# EAGLE design mytracer (EAGLE 7.1.0)
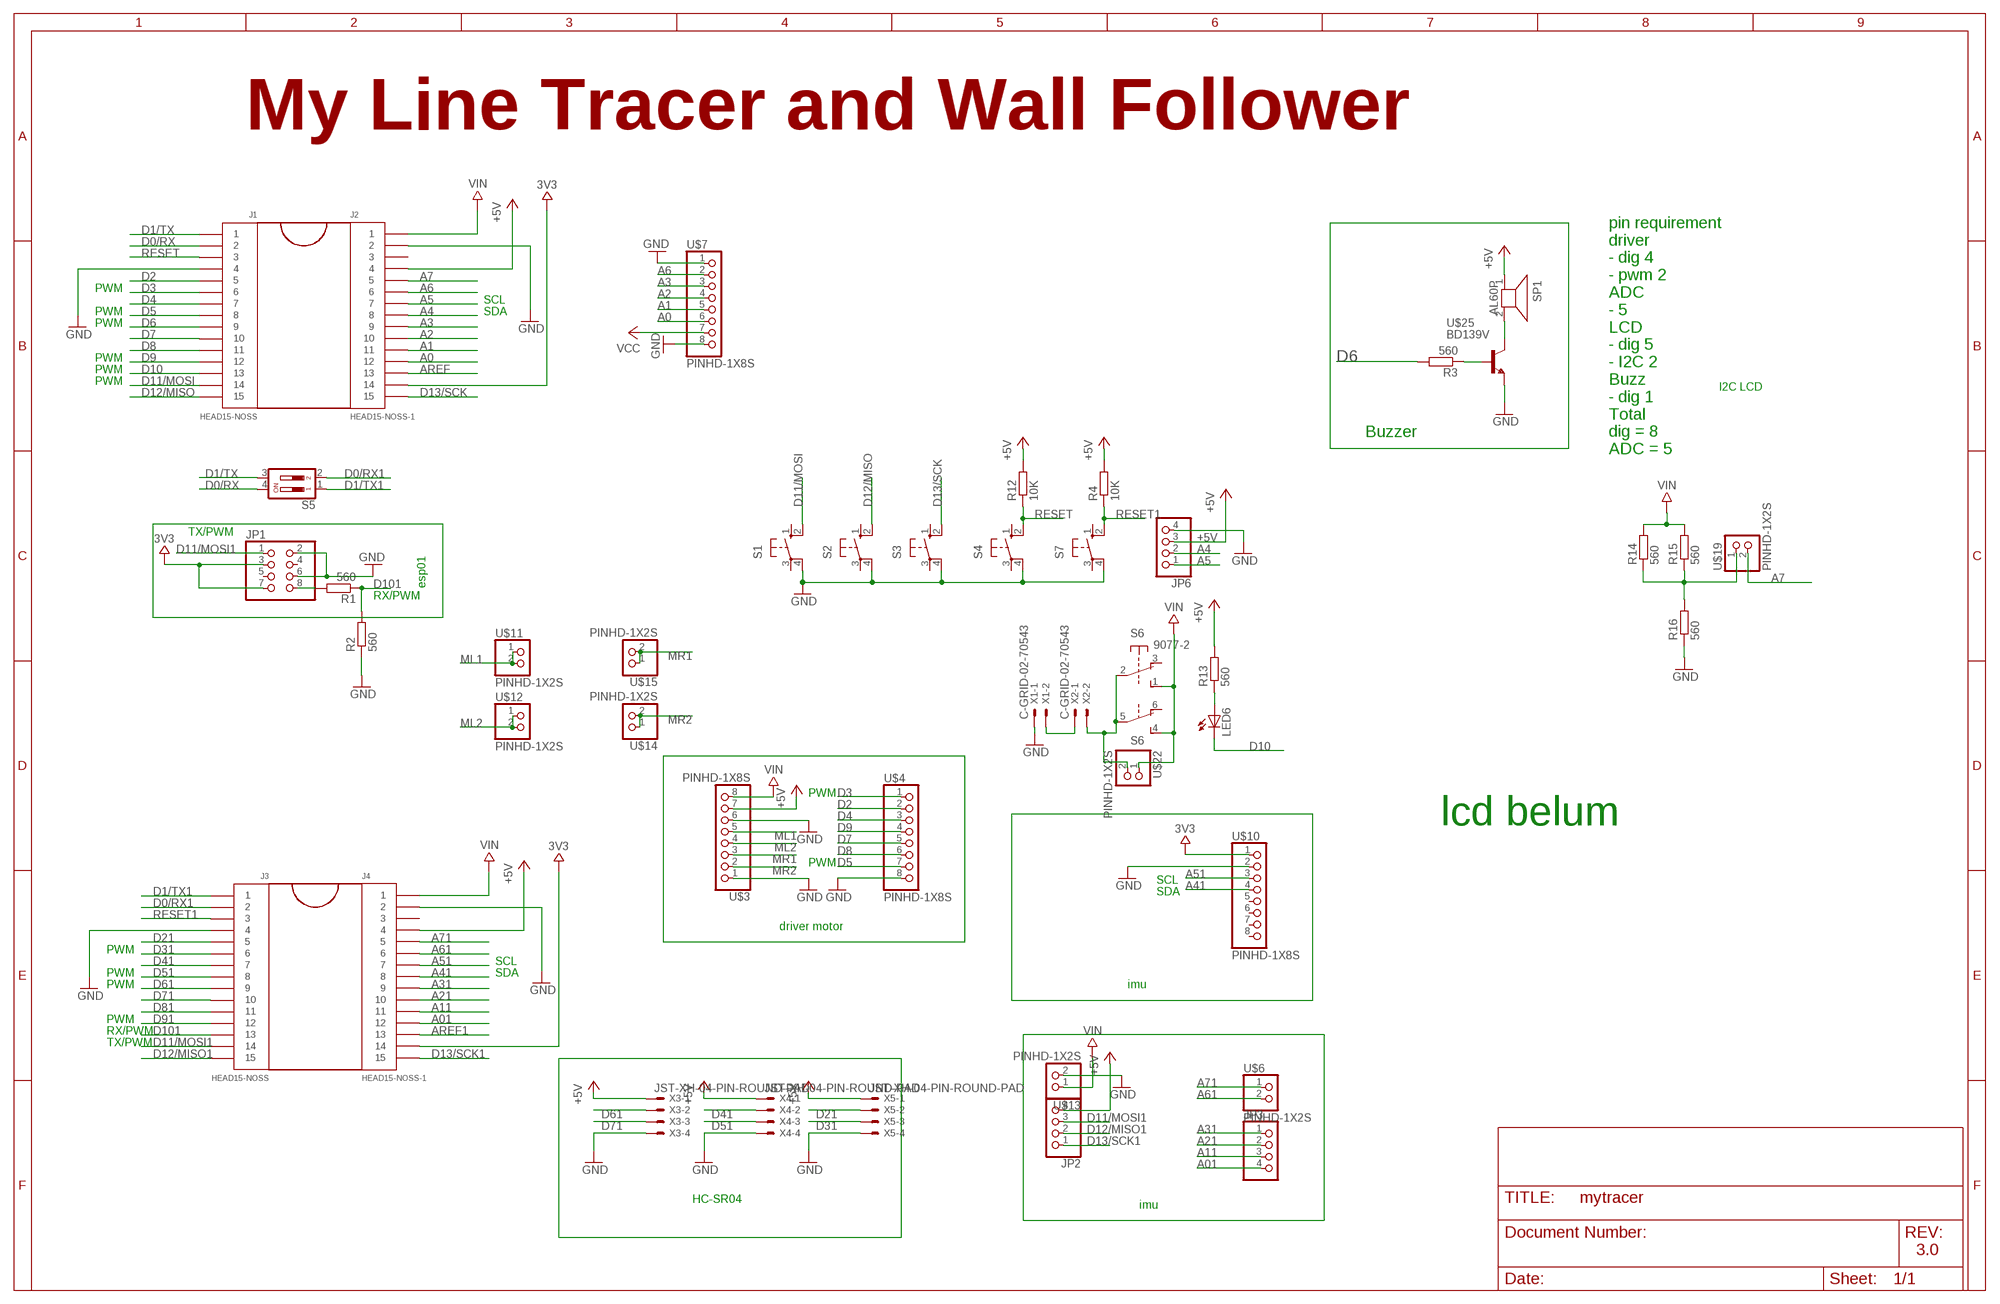
[diagram p0: schematic, sheet 1]

## Parts
J1  HEAD15-NOSS  [HEAD15-NOSS]
J2  HEAD15-NOSS-1  [HEAD15-NOSS-1]
J3  HEAD15-NOSS  [HEAD15-NOSS]
J4  HEAD15-NOSS-1  [HEAD15-NOSS-1]
JP1  PINHD-2X4  [2X04]
JP2  PINHD-1X4  [1X04]
JP3  PINHD-1X4  [1X04]
JP6  PINHD-1X4  [1X04]
LED6  LED3MM  [LED3MM]
R1  560  R-EU_M1206  [M1206]
R2  560  R-EU_M1206  [M1206]
R3  560  R-EU_M1206  [M1206]
R4  10K  R-EU_M1206  [M1206]
R12  10K  R-EU_M1206  [M1206]
R13  560  R-EU_M1206  [M1206]
R14  560  R-EU_M1206  [M1206]
R15  560  R-EU_M1206  [M1206]
R16  560  R-EU_M1206  [M1206]
S1  10-XX  [B3F-10XX]
S2  10-XX  [B3F-10XX]
S3  10-XX  [B3F-10XX]
S4  10-XX  [B3F-10XX]
S5  DIP02YL  [DIP02YL]
S6  9077-2  [9077-2]
S7  10-XX  [B3F-10XX]
SP1  AL60P  [AL60P]
U$3  PINHD-1X8S  [1X08S]
U$4  PINHD-1X8S  [1X08S]
U$6  PINHD-1X2S  [1X02S]
U$7  PINHD-1X8S  [1X08S]
U$10  PINHD-1X8S  [1X08S]
U$11  PINHD-1X2S  [1X02S]
U$12  PINHD-1X2S  [1X02S]
U$13  PINHD-1X2S  [1X02S]
U$14  PINHD-1X2S  [1X02S]
U$15  PINHD-1X2S  [1X02S]
U$19  PINHD-1X2S  [1X02S]
U$22  PINHD-1X2S  [1X02S]
U$25  BD139V  [TO126V]
X1  C-GRID-02-70543  [70543-02]
X2  C-GRID-02-70543  [70543-02]
X3  JST-XH-04-PIN-ROUND-PAD  [JST-XH-04-PACKAGE-ROUND-PAD]
X4  JST-XH-04-PIN-ROUND-PAD  [JST-XH-04-PACKAGE-ROUND-PAD]
X5  JST-XH-04-PIN-ROUND-PAD  [JST-XH-04-PACKAGE-ROUND-PAD]

## Nets
3V3: J2.14 J4.14 JP1.3 JP1.7 U$10.1
+5V: J2.4 J4.4 JP2.4 JP6.3 R4.2 R12.2 R13.2 SP1.1 U$3.7 X3.1 X4.1 X5.1
A0: J2.12 U$7.6
A1: J2.11 U$7.5
A01: J4.12 JP3.4
A2: J2.10 U$7.4
A3: J2.9 U$7.3
A4: J2.8 JP6.2
A5: J2.7 JP6.1
A6: J2.6 U$7.2
A7: J2.5 U$19.2
A11: J4.11 JP3.3
A21: J4.10 JP3.2
A31: J4.9 JP3.1
A41: J4.8 U$10.4
A51: J4.7 U$10.3
A61: J4.6 U$6.2
A71: J4.5 U$6.1
AREF: J2.13
AREF1: J4.13
D0/RX: J1.2 S5.4
D0/RX1: J3.2 S5.2
D1/TX: J1.1 S5.3
D1/TX1: J3.1 S5.1
D2: J1.5 U$4.2
D3: J1.6 U$4.1
D4: J1.7 U$4.3
D5: J1.8 U$4.7
D6: J1.9 R3.2
D7: J1.10 U$4.5
D8: J1.11 U$4.6
D9: J1.12 U$4.4
D10: J1.13 LED6.K(C)
D11/MOSI: J1.14 S1.2(S1)
D11/MOSI1: J3.14 JP1.1 JP2.3
D12/MISO: J1.15 S2.2(S1)
D12/MISO1: J3.15 JP2.2
D13/SCK: J2.15 S3.2(S1)
D13/SCK1: J4.15 JP2.1
D21: J3.5 X5.2
D31: J3.6 X5.3
D41: J3.7 X4.2
D51: J3.8 X4.3
D61: J3.9 X3.2
D71: J3.10 X3.3
D81: J3.11
D91: J3.12
D101: J3.13 R1.1 R2.2
GND: J1.4 J2.2 J3.4 J4.2 JP1.2 JP1.6 JP6.4 R2.1 R16.1 S1.4(P1) S2.4(P1) S3.4(P1) S4.4(P1) S7.4(P1) U$3.1 U$3.6 U$4.8 U$7.1 U$7.8 U$10.2 U$13.2 U$25.1(E) X1.1 X3.4 X4.4 X5.4
ML1: U$3.5 U$11.1 U$11.2
ML2: U$3.4 U$12.1 U$12.2
MR1: U$3.3 U$15.1 U$15.2
MR2: U$3.2 U$14.1 U$14.2
N$2: R14.1 R15.1 R16.2 U$19.1
N$12: JP1.8 R1.2
N$13: X1.2 X2.1
N$16: S6.2(1:P) S6.5(2:P) U$22.2 X2.2
N$17: LED6.A R13.1
N$34: R3.1 U$25.3(B)
N$35: SP1.2 U$25.2(C)
RESET: J1.3 R12.1 S4.2(S1)
RESET1: J3.3 R4.1 S7.2(S1)
VCC: U$7.7
VIN: J2.1 J4.1 R14.2 R15.2 S6.1(1:S) S6.4(2:S) U$3.8 U$13.1 U$22.1
Unconnected: J2.3 J4.3 JP1.4 JP1.5 S1.1(S) S1.3(P) S2.1(S) S2.3(P) S3.1(S) S3.3(P) S4.1(S) S4.3(P) S6.3(1:O) S6.6(2:O) S7.1(S) S7.3(P) U$10.5 U$10.6 U$10.7 U$10.8

## Notes on the sheet
- My Line Tracer and Wall Follower
- PWM
- SCL
- PWM | SDA
- PWM
- PWM
- PWM
- PWM
- I2C LCD
- Buzzer
- pin requirement
  driver
  - dig 4
  - pwm 2
  ADC
  - 5
  LCD
  - dig 5
  - I2C 2
  Buzz
  - dig 1
  Total 
  dig = 8
  ADC = 5
- TX/PWM
- esp01
- RX/PWM
- PWM
- lcd belum
- PWM
- SCL
- SDA
- driver motor
- PWM
- SCL
- PWM | SDA
- PWM | imu
- PWM
- RX/PWM
- TX/PWM
- HC-SR04
- imu
- 3.0

## Library data of the parts
J1 J3 = MyCON2:HEAD15-NOSS
J2 J4 = MyCON2:HEAD15-NOSS-1
JP1 = pinhead:PINHD-2X4: PIN HEADER
JP2 JP3 JP6 = pinhead:PINHD-1X4: PIN HEADER
LED6 = led:LED: LED OSRAM: - CHIPLED LG R971, LG N971, LY N971, LG Q971, LY Q971, LO R971, LY R971 LH N974, LH R974 LS Q976, LO Q976, LY Q976 LO Q996 - Hyper CHIPLED LW Q18S LB Q993, LB Q99A, LB R99A - SideLED LS A670, LO A670, LY A670, LG A670, LP A670 LB A673, LV A673, LT A673, LW A673 LH A674 LY A675 LS A676, LA A676, LO A676, LY A676, LW A676 LS A679, LY A679, LG A679 - Hyper Micro SIDELED® LS Y876, LA Y876, LO Y876, LY Y876 LT Y87S - SmartLED LW L88C, LW L88S LB L89C, LB L89S, LG L890 LS L89K, LO L89K, LY L89K LS L896, LA L896, LO L896, LY L896 - TOPLED LS T670, LO T670, LY T670, LG T670, LP T670 LSG T670, LSP T670, LSY T670, LOP T670, LYG T670 LG T671, LOG T671, LSG T671 LB T673, LV T673, LT T673, LW T673 LH T674 LS T676, LA T676, LO T676, LY T676, LB T676, LH T676, LSB T676, LW T676 LB T67C, LV T67C, LT T67C, LS T67K, LO T67K, LY T67K, LW E67C LS E67B, LA E67B, LO E67B, LY E67B, LB E67C, LV E67C, LT E67C LW T67C LS T679, LY T679, LG T679 LS T770, LO T770, LY T770, LG T770, LP T770 LB T773, LV T773, LT T773, LW T773 LH T774 LS E675, LA E675, LY E675, LS T675 LS T776, LA T776, LO T776, LY T776, LB T776 LHGB T686 LT T68C, LB T68C - Hyper Mini TOPLED® LB M676 - Mini TOPLED Santana® LG M470 LS M47K, LO M47K, LY M47K Source: http://www.osram.convergy.de LUXEON: - LUMILED® LXK2-PW12-R00, LXK2-PW12-S00, LXK2-PW14-U00, LXK2-PW14-V00 LXK2-PM12-R00, LXK2-PM12-S00, LXK2-PM14-U00 LXK2-PE12-Q00, LXK2-PE12-R00, LXK2-PE12-S00, LXK2-PE14-T00, LXK2-PE14-U00 LXK2-PB12-K00, LXK2-PB12-L00, LXK2-PB12-M00, LXK2-PB14-N00, LXK2-PB14-P00, LXK2-PB14-Q00 LXK2-PR12-L00, LXK2-PR12-M00, LXK2-PR14-Q00, LXK2-PR14-R00 LXK2-PD12-Q00, LXK2-PD12-R00, LXK2-PD12-S00 LXK2-PH12-R00, LXK2-PH12-S00 LXK2-PL12-P00, LXK2-PL12-Q00, LXK2-PL12-R00 Source: www.luxeon.com KINGBRIGHT: KA-3528ASYC Source: www.kingbright.com
R1-R4 R12-R16 = rcl:R-EU_: RESISTOR, European symbol
S1-S4 S7 = switch-omron:10-XX: OMRON SWITCH; MPN: B3F-1000; OC_FARNELL: 176432; OC_NEWARK: 36M3542
S5 = switch-dil:DIP02YL: DIL/CODE SWITCH; OC_FARNELL: unknown; OC_NEWARK: unknown
S6 = switch-misc:9077-2: MARQUARDT SWITCH 9077.0200 Distributor: Buerklin <https://www.buerklin.com/default.asp?event=ShowArtikel%2812G2822%29&l=d&jump=ArtNr_12G2822>
SP1 = buzzer:AL60P: SPEAKER Source: Buerklin; OC_FARNELL: unknown; OC_NEWARK: unknown
U$3 U$4 U$7 U$10 = pinhead:PINHD-1X8S
U$6 U$11-U$15 U$19 U$22 = pinhead:PINHD-1X2S
U$25 = transistor-npn:BD139V
X1 X2 = con-molex:C-GRID-02: CONNECTOR wire to board 2.54 mm (0.100") pitch header; OC_FARNELL: unknown; OC_NEWARK: unknown
X3-X5 = JST XH Connectors v1-0:JST-XH-04-PIN: JST XH Connector 2 Pin Wire to board connector. Pitch: 2,54 mm, (0.100") Number of pins: 4 Created by Rembrandt Electronics www.rembrandtelectronics.com

## Net classes
0 default: width 0.203 mm

## Board
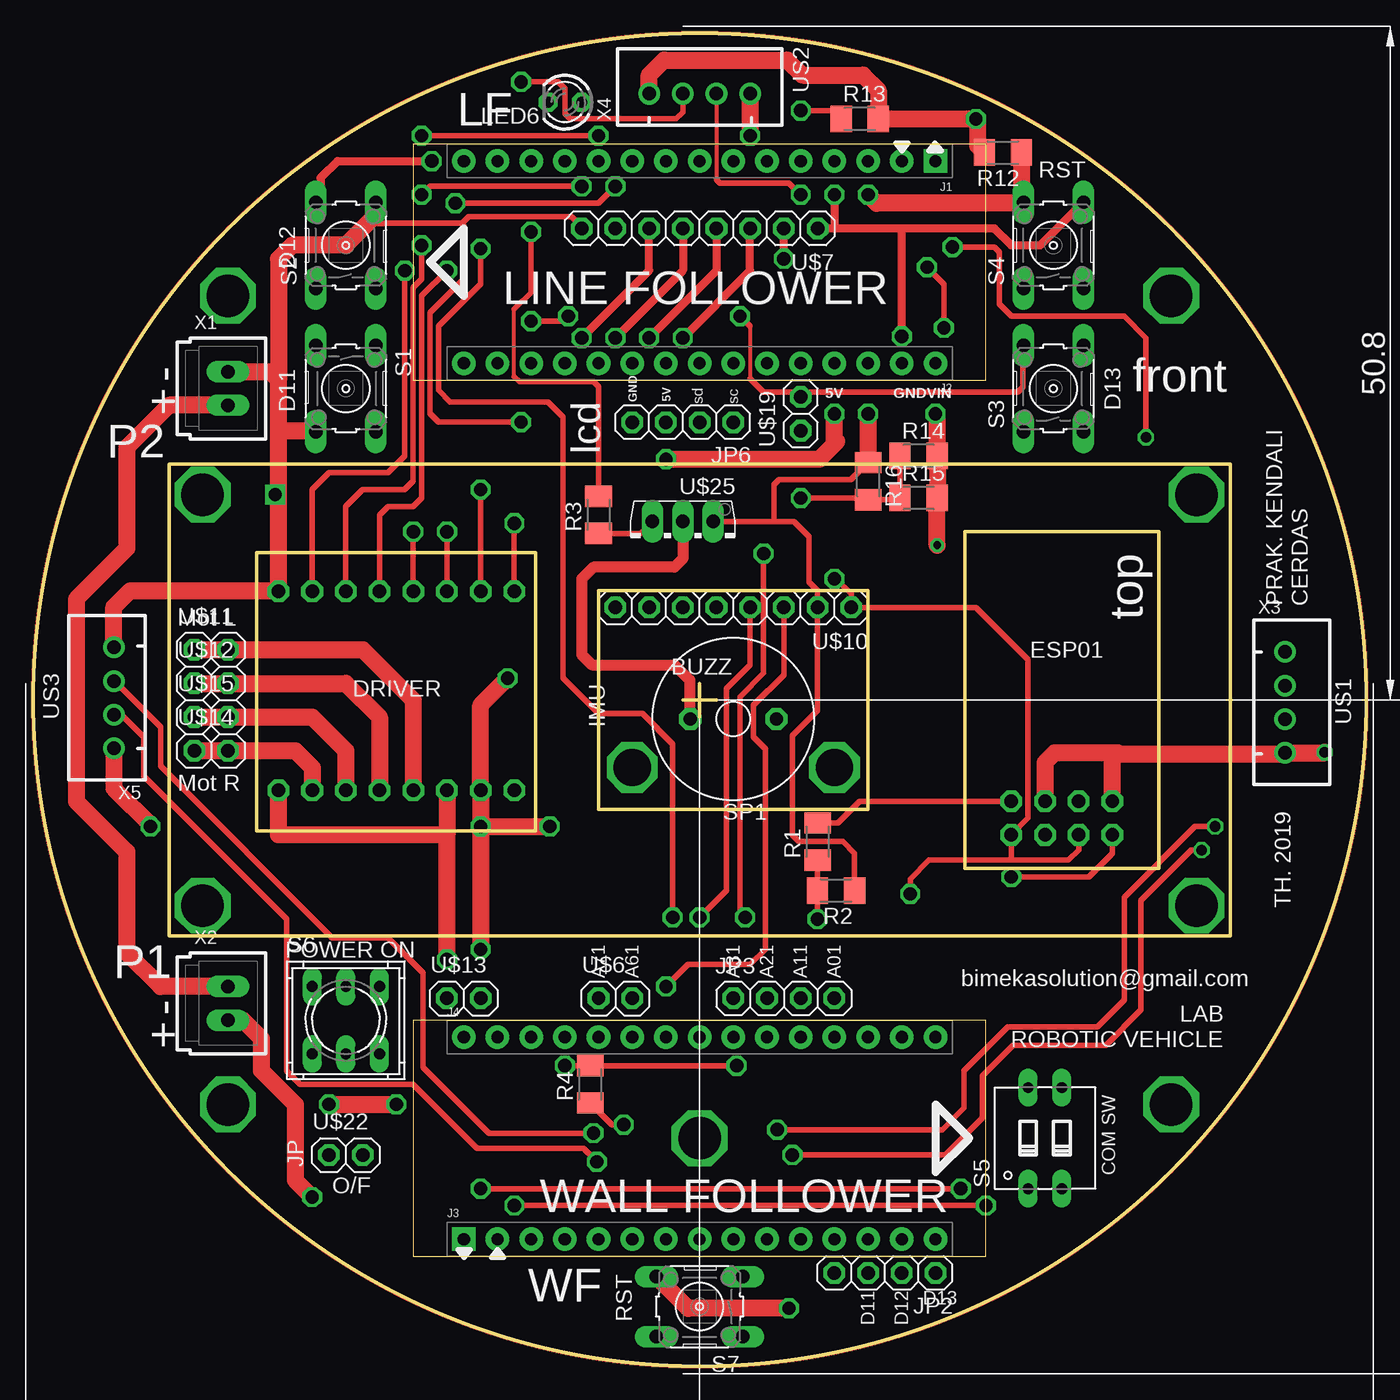
[diagram p1: board, top side]
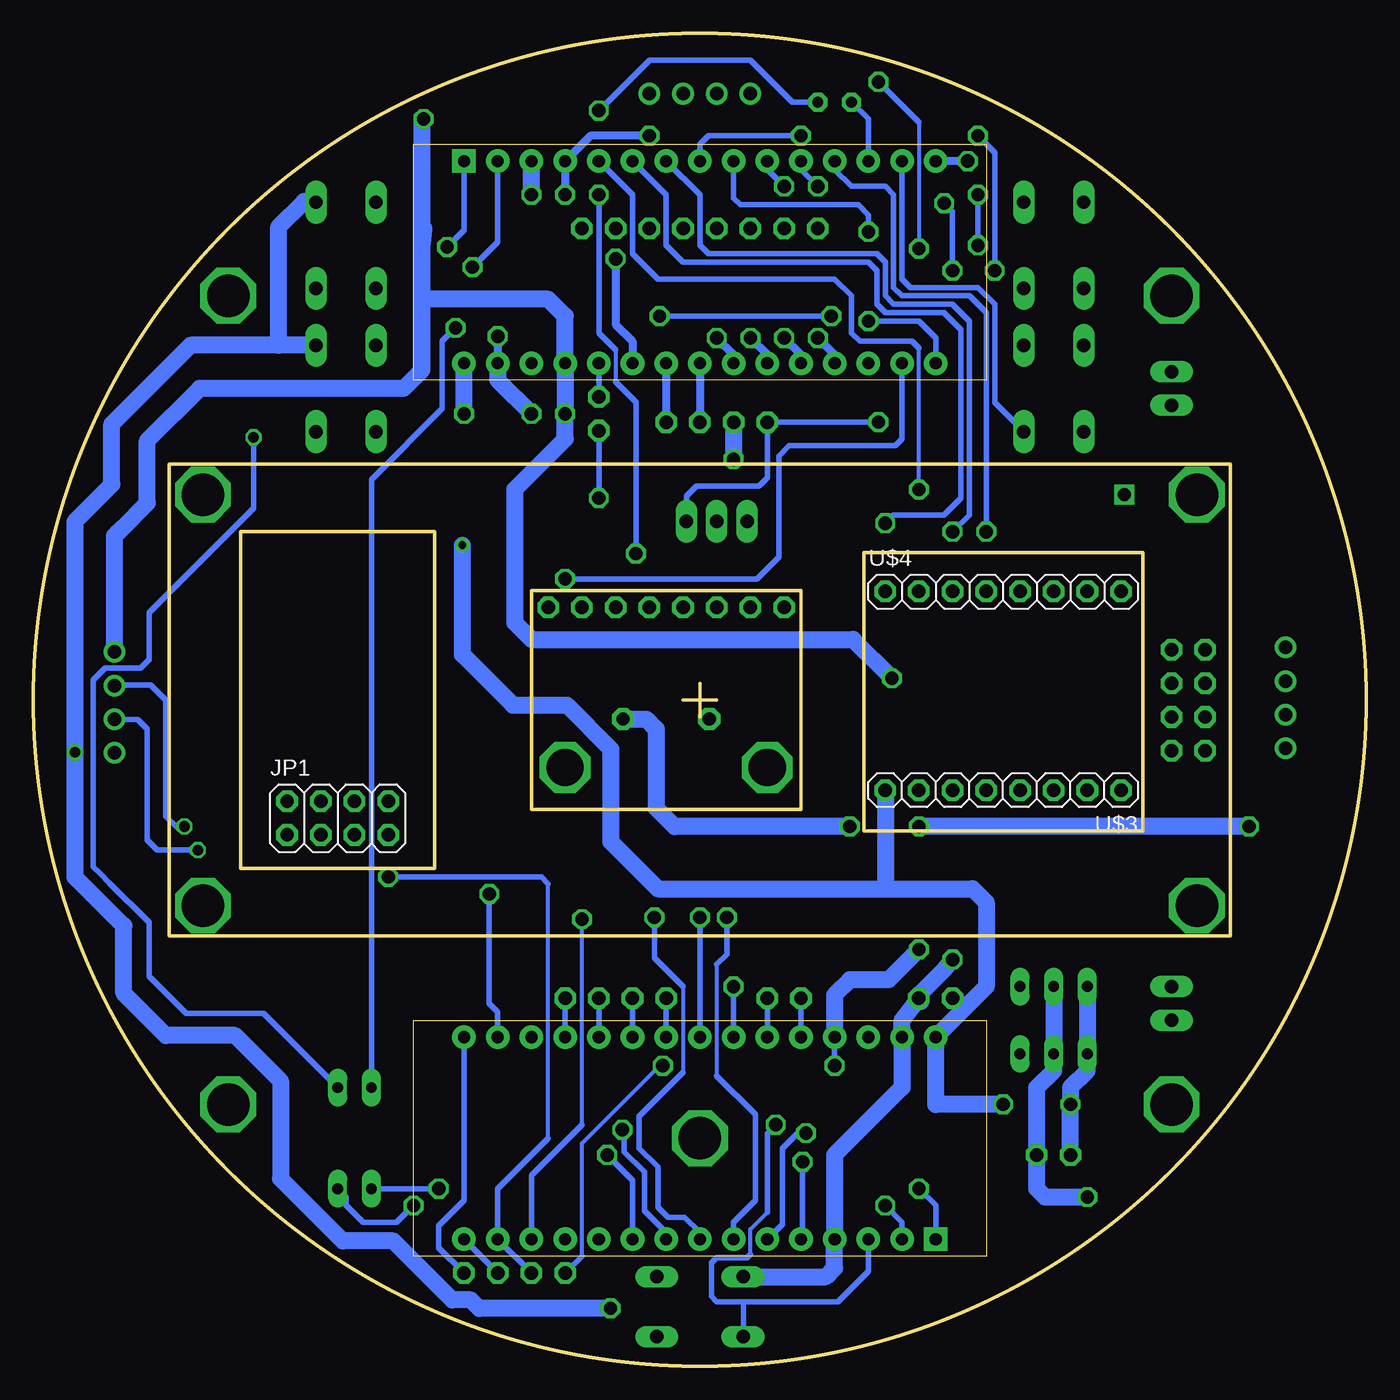
[diagram p2: board, bottom side, seen from below]

Size 100.5 x 100.5 mm. Coordinates in mm from the lower left corner, seen from the top.
Outline: 50.24,51.49 50.24,48.95
Outline: 48.97,50.22 51.51,50.22
Outline: 28.65,92.13 28.65,74.35 71.83,74.35 71.83,92.13 28.65,92.13
Outline: 71.83,8.31 71.83,26.09 28.65,26.09 28.65,8.31 71.83,8.31
Outline: 62.94,58.47 42.62,58.47 42.62,41.96 62.94,41.96 62.94,58.47
Outline: 70.24,37.52 84.85,37.52 84.85,62.92 70.24,62.92 70.24,37.52
Outline: 16.84,40.38 37.86,40.38 37.86,61.33 16.84,61.33 16.84,40.38
Outline: 10.23,68 90.24,68 90.24,32.44 10.23,32.44 10.23,68
Outline: circle at 50.25,50.25 radius 50.25
Copper layers (1*16): Top 0.035mm / dielectric 1.5mm / Bottom 0.035mm
Design rules "default *": minimum track width 8mil, minimum drill 16mil, track to track 8mil, track to pad 8mil, pad to pad 8mil, via to via 8mil, smd to smd 8mil, copper to edge 8mil, drill to drill 8mil, minimum pad ring 12mil, minimum via ring 8mil, stop-mask expansion 4mil, vias tented up to drill 18mil, thermal gap 10mil

### Footprints (pad centres in the part's own frame; a part is rotated, then mirrored left to right if it is on the bottom)
HEAD15-NOSS = drill 0.914 pad 1.778 square: 1 0,0 | drill 0.914 pad 1.778: 2 2.54,0; 3 5.08,0; 4 7.62,0; 5 10.16,0; 6 12.7,0; 7 15.24,0; 8 17.78,0; 9 20.32,0; 10 22.86,0; 11 25.4,0; 12 27.94,0; 13 30.48,0; 14 33.02,0; 15 35.56,0
HEAD15-NOSS-1 = drill 0.914 pad 1.778: 1 0,0; 2 2.54,0; 3 5.08,0; 4 7.62,0; 5 10.16,0; 6 12.7,0; 7 15.24,0; 8 17.78,0; 9 20.32,0; 10 22.86,0; 11 25.4,0; 12 27.94,0; 13 30.48,0; 14 33.02,0; 15 35.56,0
2X04 = drill 1.016 octagon: 1 -3.81,-1.27; 2 -3.81,1.27; 3 -1.27,-1.27; 4 -1.27,1.27; 5 1.27,-1.27; 6 1.27,1.27; 7 3.81,-1.27; 8 3.81,1.27
1X04 = drill 1.016 octagon: 1 -3.81,0; 2 -1.27,0; 3 1.27,0; 4 3.81,0
LED3MM = drill 0.813 octagon: A -1.27,0; K 1.27,0
M1206 = smd 1.6 x 2: 1 -1.4,0; 2 1.4,0
B3F-10XX = drill 1.016 long: 1 -3.251,2.261; 2 3.251,2.261; 3 -3.251,-2.261; 4 3.251,-2.261
DIP02YL = drill 0.813 long: 1 -1.27,-3.81; 2 1.27,-3.81; 3 1.27,3.81; 4 -1.27,3.81
9077-2 = drill 0.813 long: 1 -2.54,2.54; 2 0,2.54; 3 2.54,2.54; 4 -2.54,-2.54; 5 0,-2.54; 6 2.54,-2.54
AL60P = drill 1 pad 1.676 octagon: 1 -3.251,0; 2 3.251,0
1X08S = drill 1.016 octagon: 1 -8.89,-1.27; 2 -6.35,-1.27; 3 -3.81,-1.27; 4 -1.27,-1.27; 5 1.27,-1.27; 6 3.81,-1.27; 7 6.35,-1.27; 8 8.89,-1.27
1X02S = drill 1.016 octagon: 1 -1.27,0; 2 1.27,0
TO126V = drill 1.016 long: 1 -2.286,-1.27; 2 0,-1.27; 3 2.286,-1.27
70543-02 = drill 1.016 long: 1 -1.27,0; 2 1.27,0
JST-XH-04-PACKAGE-ROUND-PAD = drill 1.016: 1 -3.81,0; 2 -1.27,0; 3 1.27,0; 4 3.81,0

### Placement (x,y rotation side)
J1  68.02,90.86 180 top
J2  68.02,75.62 180 top
J3  32.46,9.58 0 top
J4  32.46,24.82 0 top
JP1  77.54,41.33 0 bottom
JP2  64.21,7.04 180 top
JP3  56.59,27.74 0 top
JP6  48.97,71.17 180 top
LED6  40.08,95.3 180 top
R1  59.13,39.55 90 top
R2  60.53,35.87 180 top
R3  42.62,64.19 90 top
R4  41.98,21.26 90 top
R12  73.1,91.49 180 top
R13  62.3,94.03 0 top
R14  66.75,68.63 0 top
R15  66.75,65.46 0 top
R16  62.94,66.73 270 top
S1  23.57,73.71 270 top
S2  23.57,84.51 90 top
S3  76.91,73.71 90 top
S4  76.91,84.51 90 top
S5  76.27,17.2 0 top
S6  23.57,26.09 0 top
S7  50.24,4.5 180 top
SP1  52.78,48.8 180 top
U$3  27.38,42.15 180 bottom
U$4  27.38,59.68 0 bottom
U$6  43.89,27.74 0 top
U$7  50.24,84.51 180 top
U$10  52.78,55.93 180 top
U$11  13.41,54.03 0 top
U$12  13.41,51.49 0 top
U$13  32.46,27.74 0 top
U$14  13.41,46.41 0 top
U$15  13.41,48.95 0 top
U$19  57.86,71.81 90 top
U$22  23.57,15.93 0 top
U$25  48.97,62.44 180 top
X1  14.68,73.71 270 top
X2  14.68,27.36 270 top
X3  94.37,50.05 270 top
X4  50.24,95.94 0 top
X5  6.08,50.39 90 top

### Tracks (layer width: path | path; a pad name or v marks a point on that pad's centre or on a via)
3V3  (via drill 1)
  Top 0.406: 73.73,38.15 JP1.7 75,41.33 75,53.27 71.07,57.2 U$10.1 61.67,58.22 60.53,59.36 v60.4,59.36 | 73.73,38.15 67.51,38.15 66.11,36.76 v66.11,35.61 | 73.73,38.15 78.05,38.15 78.81,38.92 JP1.3
  Bottom 0.406: J4.14 65.48,26.72 66.11,27.36 v66.11,35.61 | v60.4,59.36 45.92,59.36 44.27,61.01 44.27,68.63 43.51,69.4 35.51,69.4 35,69.9 J2.14
+5V  (via drill 1)
  Top 0.406: v40.08,22.66 R4.2 v53.03,22.66
  Top 1.27: v33.73,40.69 U$3.7 33.73,49.84 v35.76,51.87 | X5.1 6.08,43.57 8.96,40.69 v8.84,40.69 | R12.2 71.19,92 71.19,94.03 v71.07,94.03 R13.2 63.7,96.19 62.56,97.34 57.99,97.34 56.84,98.48 47.57,98.48 46.43,97.34 X4.1 | v47.7,68.38 59.26,68.38 60.59,69.71 60.4,69.9 v60.4,71.81 | v33.73,40.69 v38.94,40.69 | v33.73,40.69 v33.73,31.42
  Bottom 0.305: 59.13,8.31 59.13,16.82 53.29,22.66 v53.03,22.66
  Bottom 0.406: J4.4 v40.08,22.66 | JP2.4 59.13,8.31
  Bottom 1.27: v8.84,40.69 v33.73,40.69 | 71.19,80.44 71.19,75.11 72.59,73.71 87.96,73.71 91.89,69.78 91.89,65.08 93.8,63.17 94.01,62.96 94.37,62.6 X3.1 | 71.19,80.44 71.19,84.64 | 71.19,84.64 71.19,93.91 v71.07,94.03 | 71.07,85.78 71.19,84.64 | JP6.3 v47.7,68.38 | 71.19,80.44 61.67,80.44 60.4,79.17 J2.4 v60.4,71.81 60.4,69.9 64.21,66.09 64.21,56.06 62.94,54.79 38.68,54.79 v35.76,51.87 | v38.94,40.69 52.14,40.69 53.54,42.09 53.54,48.06 54.28,48.8 SP1.1 | v33.73,31.42 36.01,29.14 38.94,29.14 40.08,27.99 J4.4
A0  (via drill 1)
  Top 0.61: v41.35,77.52 46.43,82.6 U$7.6
  Bottom 0.61: J2.12 40.08,76.25 v41.35,77.52
A1  (via drill 1)
  Top 0.61: U$7.5 48.97,82.6 v43.89,77.52
  Bottom 0.61: J2.11 42.62,76.25 v43.89,77.52
A01
  Bottom 0.406: J4.12 JP3.4
A2  (via drill 1)
  Top 0.61: U$7.4 51.51,82.6 v46.43,77.52
  Bottom 0.61: v46.43,77.52 45.16,76.25 J2.10
A3  (via drill 1)
  Top 0.61: v48.97,77.52 54.05,82.6 U$7.3
  Bottom 0.61: v48.97,77.52 47.7,76.25 J2.9
A4
  Bottom 0.61: J2.8 JP6.2
A5
  Bottom 0.61: J2.7 JP6.1
A6  (via drill 1)
  Top 0.61: v56.59,83.49 U$7.2
  Bottom 0.61: 55.32,76.25 J2.6 55.32,77.27 56.59,78.54 v56.59,83.49
A7
  Bottom 0.406: J2.5 U$19.2
A11
  Bottom 0.406: J4.11 JP3.3
A21
  Bottom 0.406: J4.10 JP3.2
A31
  Bottom 0.406: J4.9 JP3.1
A41  (via drill 1)
  Top 0.406: U$10.4 54.05,52.89 52.27,51.11 52.27,35.87 v50.24,33.84
  Bottom 0.406: J4.8 v50.24,33.84
A51  (via drill 1)
  Top 0.406: v47.7,28.63 49.35,30.28 54.05,30.28 55.19,31.42 55.19,46.54 54.3,47.42 54.3,49.84 56.59,52.12 U$10.3
  Bottom 0.406: v47.7,28.63 J4.7
A61
  Bottom 0.406: J4.6 U$6.2
A71
  Bottom 0.406: J4.5 U$6.1
D0/RX  (via drill 1)
  Top 0.406: v67.38,82.86 68.65,81.59 v68.65,78.29
  Bottom 0.406: J1.2 65.48,84.76 v67.38,82.86 | v68.65,78.29 69.67,77.27 69.67,72.19 75,66.86 S5.4
D0/RX1  (via drill 1)
  Top 0.406: v71.83,12.12 37.54,12.12 v36.27,12.12
  Bottom 0.406: S5.2 76.91,12.75 76.91,12.12 75.64,10.85 73.1,10.85 v71.83,12.12 | J3.2 35,10.85 v36.27,12.12
D1/TX  (via drill 0.8, 1)
  Top 0.406: v69.29,84.38 72.46,84.38 72.84,84 72.84,80.06 73.73,79.17 82.24,79.17 83.89,77.52 v83.89,70.03
  Bottom 0.406: J1.1 68.02,85.65 v69.29,84.38 | S5.3 83.13,26.6 88.97,26.6 91.77,29.39 91.77,33.45 94.75,36.44 95.45,37.14 95.96,37.65 95.96,51.74 95.07,52.63 92.4,52.63 91.77,53.27 91.77,56.82 83.89,64.7 v83.89,70.03
D1/TX1  (via drill 1)
  Top 0.406: v33.73,13.39 v69.92,13.39
  Bottom 0.406: S5.1 71.83,13.39 v69.92,13.39 | J3.1 32.46,12.12 v33.73,13.39
D2  (via drill 1)
  Top 0.406: U$4.2 v33.73,66.09
  Bottom 0.305: v33.73,66.09 33.73,76.76
  Bottom 0.406: J1.5 55.32,88.32 55.32,83.87 53.41,81.97 40.08,81.97 38.81,80.7 38.81,77.9 38.17,77.27 34.24,77.27 33.73,76.76
D3  (via drill 1)
  Top 0.406: v36.27,63.55 U$4.1
  Bottom 0.406: J1.6 52.78,88.32 52.78,84.51 51.51,83.24 37.54,83.24 36.9,82.6 36.9,80.06 36.27,79.43 31.82,79.43 30.55,78.16 30.55,65.46 31.82,64.19 35.63,64.19 v36.27,63.55
D4  (via drill 1)
  Top 0.406: U$4.3 31.19,61.65 v31.19,62.92
  Bottom 0.406: J1.7 50.24,88.32 50.24,84.51 49.6,83.87 36.9,83.87 36.27,83.24 36.27,80.7 35.63,80.06 31.19,80.06 29.92,78.79 29.92,64.19 v31.19,62.92
D5  (via drill 1)
  Top 0.406: U$4.7 21.03,66.09 22.3,67.36 26.74,67.36 28.01,68.63 v28.01,82.6 | v42.62,92.76 v29.28,92.76
  Bottom 0.406: v28.01,82.6 28.01,91.49 v29.28,92.76 | J1.8 50.24,92.13 49.6,92.76 v42.62,92.76
D6  (via drill 1)
  Top 0.305: 36.27,74.6 36.27,79.68
  Top 0.406: v37.54,85.52 37.54,80.95 36.27,79.68 | 36.27,74.6 36.65,74.22 42.24,74.22 42.62,73.84 R3.2
  Bottom 0.406: J1.9 47.7,88.06 47.19,87.56 38.3,87.56 37.54,86.79 v37.54,85.52
D7  (via drill 1)
  Top 0.406: v43.89,88.95 42.62,87.68 v31.82,87.68 | v31.19,82.6 29.28,80.7 29.28,65.46 28.65,64.82 26.74,64.82 26.11,64.19 U$4.5
  Bottom 0.406: J1.10 45.16,90.22 v43.89,88.95 | v31.82,87.68 31.19,87.05 v31.19,82.6
D8  (via drill 1)
  Top 0.406: U$4.6 23.57,64.82 24.84,66.09 28.01,66.09 28.65,66.73 28.65,81.33 29.28,81.97 v29.28,84.51 | v41.35,88.95 29.92,88.95 v29.28,88.32
  Bottom 0.406: J1.11 42.62,90.22 v41.35,88.95 | v29.28,84.51 v29.28,88.32
D9  (via drill 1)
  Top 0.406: U$4.4 v28.65,62.92
  Bottom 0.406: J1.12 40.08,90.22 38.81,88.95 36.27,88.95 35.63,88.32 35.63,81.33 35,80.7 29.92,80.7 28.65,79.43 v28.65,62.92
D10
  Bottom 0.406: J1.13 37.54,94.03 LED6.K
D11/MOSI
  Bottom 0.406: S1.2 28.01,72.65 28.01,80.06 29.28,81.33 34.36,81.33 35,81.97 J1.14
  Bottom 0.61: S1.2 26.03,70.46
D11/MOSI1  (via drill 1)
  Top 0.406: v73.73,36.88 79.58,36.88 81.35,38.66 JP1.1
  Bottom 0.305: 61.67,17.2 61.67,36.38
  Bottom 0.406: 61.67,36.38 62.18,36.88 v73.73,36.88 | JP2.3 J3.14 65.48,13.39 61.67,17.2
D12/MISO  (via drill 1)
  Top 0.61: S2.2 21.66,88.12 21.66,89.59 22.93,90.86 v30.05,90.86
  Bottom 0.61: v30.05,90.86 J1.15
D12/MISO1
  Bottom 0.406: JP2.2 J3.15
D13/SCK  (via drill 1)
  Top 0.305: 54.05,78.41 54.05,74.48
  Top 0.406: v37.54,78.79 39.95,78.79 v40.33,79.17 | S3.2 74.6,77.02 74.6,73.82 74.24,73.46 55.06,73.46 54.05,74.48 | 54.05,78.41 v53.29,79.17
  Bottom 0.406: J2.15 32.46,77.52 33.73,78.79 v37.54,78.79 | v40.33,79.17 v53.29,79.17
D13/SCK1
  Bottom 0.406: J4.15 68.02,12.5 69.92,10.59 69.92,8.94 JP2.1
D21  (via drill 1)
  Top 0.406: X5.2 6.63,49.12 8.33,47.42 8.33,44.5 19.12,33.71 19.12,22.28 20.14,21.26 28.65,21.26 33.47,16.44 41.48,16.44 v42.49,15.42
  Bottom 0.406: v42.49,15.42 42.49,9.71 J3.5
D31  (via drill 1)
  Top 0.406: X5.3 6.13,51.66 9.6,48.19 9.6,45.27 22.55,32.31 26.74,32.31 29.41,29.64 29.41,22.53 34.36,17.58 v42.24,17.58
  Bottom 0.406: J3.6 44.02,10.72 44.02,16.44 42.87,17.58 v42.24,17.58
D41  (via drill 1)
  Top 0.406: v33.73,84.25 33.73,81.59 30.55,78.41 30.55,73.59 31.44,72.7 38.81,72.7 39.95,71.55 39.95,51.87 42.62,49.2 45.92,49.2 48.21,46.92 v48.21,33.84 | X4.2 48.97,94.54 48.46,94.03 40.46,94.03 40.08,94.41 40.08,96.32 39.57,96.83 v36.78,96.83
  Bottom 0.305: 33.73,93.78 v33.73,84.25 | 48.97,30.28 48.97,21.9
  Bottom 0.406: 48.97,21.9 46.05,18.98 46.05,12.5 47.7,10.85 J3.7 | 33.73,93.78 v36.78,96.83 | v48.21,33.84 48.21,31.04 48.97,30.28
D51  (via drill 1)
  Top 0.305: X4.3 51.51,89.46
  Top 0.406: 51.51,89.46 51.76,89.21 56.97,89.21 v57.86,88.32 | v55.06,61.27 55.06,52.25 53.29,50.47 53.29,34.22 v53.67,33.84
  Bottom 0.305: 56.59,76.63 56.59,74.22 | 51.51,28.63 51.51,22.15
  Bottom 0.406: v55.06,61.27 55.06,72.7 56.59,74.22 | 56.59,76.63 57.86,77.9 v57.86,88.32 | 51.51,28.63 53.67,30.79 v53.67,33.84 | 51.51,22.15 54.81,18.85 54.81,16.44 53.41,15.04 53.41,11.99 52.65,11.23 51.38,11.23 50.24,10.09 J3.8
D61  (via drill 0.8, 1)
  Top 0.406: v56.08,17.83 68.53,17.83 70.18,19.48 70.18,22.28 73.48,25.58 80.21,25.58 82.24,27.61 82.24,35.36 87.58,40.69 v89.1,40.69
  Bottom 0.406: J3.9 52.78,10.09 54.43,11.74 54.43,14.66 55.95,16.18 55.95,17.71 v56.08,17.83 | v89.1,40.69 89.74,40.69 90.5,41.46 90.5,50.22 91.64,51.36 94.33,51.36 X3.2
D71  (via drill 0.8, 1)
  Top 0.406: v57.22,15.93 68.78,15.93 71.57,18.72 71.57,21.9 73.86,24.18 80.85,24.18 83.51,26.85 83.51,35.11 87.32,38.92 v88.08,38.92
  Bottom 0.406: J3.10 55.32,14.02 v57.22,15.93 | v88.08,38.92 91.13,38.92 91.89,39.68 91.89,48.06 92.61,48.78 X3.3
D101  (via drill 1)
  Top 0.406: R1.1 59.13,34.47 R2.2 59.13,34.21 v59.13,33.71
  Bottom 0.305: 59.13,18.21 v59.13,33.71
  Bottom 0.406: J3.13 62.94,14.4 59.13,18.21
GND  (via drill 0.8, 1)
  Top 0.406: v36.78,71.17 30.55,71.17 29.92,71.81 29.92,79.43 32.46,81.97 32.46,86.03 32.33,86.16 | U$7.8 41.35,85.91 40.59,86.67 32.84,86.67 32.33,86.16 | 32.33,86.16 26.49,86.16 26.46,86.13 26.01,86.13 25.6,86.54 | R16.1 61.67,66.86 56.21,66.86 55.83,66.47 55.83,63.68 | R2.1 61.93,38.66 61.03,39.55 57.73,39.55 57.22,40.06 57.22,47.55 59.13,49.46 U$10.2 59.13,58.47 58.49,59.11 58.49,62.54 57.35,63.68 55.83,63.68 | JP1.2 81.48,42.6 | 55.83,63.68 51.28,63.68 U$25.1
  Top 0.61: v60.4,88.32 60.4,85.78 | 60.4,85.78 U$7.1 | 65.48,85.78 72.46,85.78 73.73,84.51 75.92,84.51 S4.4 | 65.48,85.78 60.4,85.78 | v65.48,77.65 65.48,85.78
  Top 1.27: X1.1 17.85,74.98 18.49,74.35 | 18.49,70.54 21.23,70.54 S1.4 | S2.4 25.83,86.77 25.6,86.54 23.57,84.51 19.5,84.51 18.49,83.49 18.49,74.35 | v31.19,30.66 31.19,40.06 | X4.4 v54.05,92.76 | X5.4 6.08,57.24 7.31,58.47 18.43,58.47 U$4.8 18.49,70.54 | v62.94,71.81 R16.1 | v56.97,4.37 49.37,4.37 S7.4 | JP1.6 76.27,45.52 76.99,46.24 81.73,46.24 81.35,45.86 JP1.2 81.35,46.15 94.29,46.15 X3.4 97.31,46.24 v97.36,46.28 | 18.49,70.54 18.49,74.35 | U$3.6 31.19,40.06 | 31.19,40.06 18.49,40.06 U$3.1
  Bottom 0.406: v36.78,71.17 JP6.4 45.16,66.98 45.79,66.35 50.49,66.35 51.25,65.59 U$25.1
  Bottom 0.61: v54.05,92.76 58.49,92.76 J1.4 v60.4,88.32 | v65.48,77.65 J2.2
  Bottom 1.27: J2.2 65.48,74.35 v62.94,71.81 | v31.19,30.66 31.82,29.9 33.6,28.12 33.6,27.49 U$13.2 35,26.09 J4.2 35,21.01 40.08,15.93 J3.4 40.08,7.42 40.74,6.76 S7.4 | v56.97,4.37 66.88,4.37 67.51,5.01 68.91,5.01 73.35,9.45 77.16,9.45 81.86,14.15 81.86,21.52 85.29,24.95 90.5,24.95 93.67,28.12 93.67,33.2 97.36,36.88 v97.36,46.28 97.36,63.68 94.56,66.47 94.56,71.05 88.64,76.96 S3.4 81.99,76.96 81.99,85.91 80.08,87.81 79.22,87.81 S4.4
ML1
  Top 1.27: U$11.1 U$11.2 24.84,54.03 28.65,50.22 U$3.5
ML2
  Top 1.27: U$12.1 U$12.2 23.57,51.49 26.11,48.95 U$3.4
MR1
  Top 1.27: U$15.1 U$15.2 21.03,48.95 23.57,46.41 U$3.3
MR2
  Top 1.27: U$14.1 U$14.2 19.76,46.41 21.03,45.14 U$3.2
N$2  (via drill 1)
  Top 0.406: R14.1 R15.1 65.22,65.33 R16.2 62.81,65.46 v57.86,65.46
  Bottom 0.406: U$19.1 v57.86,65.46
N$3  (via drill 3.2)
  other vias: 12.77,65.71
N$4  (via drill 1)
  other vias: 18.23,65.71
N$5  (via drill 2.8)
  other vias: 45.16,45.14
N$6  (via drill 3.2)
  other vias: 12.77,34.72
N$7  (via drill 3.2)
  other vias: 87.7,34.72
N$8  (via drill 3.2)
  other vias: 87.7,65.71
N$10  (via drill 2.8)
  other vias: 60.4,45.14
N$12
  Top 0.406: R1.2 60.66,40.95 62.3,42.6 JP1.8
N$13
  Top 1.27: X1.2 10.23,72.44 7.06,69.27 7.06,61.65 3.25,57.84 3.25,42.6 7.06,38.79 7.06,31.17 9.6,28.63 X2.1
N$15  (via drill 3.2)
  other vias: 14.68,80.7
N$16  (via drill 1)
  Top 1.27: v21.03,12.75 19.76,14.02 19.76,19.74 17.22,22.28 17.22,24.69 15.82,26.09 X2.2
  Bottom 1.27: S6.2 S6.5 23.57,22.28 24.84,21.01 U$22.2 24.84,13.39 24.2,12.75 v21.03,12.75
N$17  (via drill 1)
  Top 0.406: v57.86,94.67 60.27,94.67 R13.1
  Bottom 0.406: v57.86,94.67 54.05,98.48 46.43,98.48 43.25,95.3 LED6.A
N$18  (via drill 3.2)
  other vias: 85.8,80.7
N$19  (via drill 3.2)
  other vias: 50.24,17.2
N$20  (via drill 3.2)
  other vias: 85.8,19.74
N$21  (via drill 3.2)
  other vias: 14.68,19.74
N$34
  Top 0.406: R3.1 45.77,62.79 U$25.3
N$35
  Top 0.813: U$25.2 48.97,60.89 48.33,60.25 42.24,60.25 41.35,59.36 41.35,53.65 42.11,52.89 48.33,52.89 49.48,51.74 49.48,48.85 SP1.2
RESET  (via drill 1)
  Top 1.27: S4.2 74.5,87.91 R12.1 74.5,87.81 74.37,87.68 63.57,87.68 v62.94,88.32
  Bottom 1.27: v62.94,88.32 J1.3
RESET1  (via drill 1)
  Top 0.406: v44.52,18.21 43.63,18.21 R4.1
  Bottom 0.305: 46.43,8.44 46.43,10.34 45.16,11.61
  Bottom 0.406: 46.94,4.88 48.97,4.88 49.35,5.26 49.35,7.8 48.97,8.18 46.68,8.18 46.43,8.44 | 46.94,4.88 39.82,4.88 37.54,7.17 J3.3 | S7.2 46.94,2.29 46.94,4.88 | 45.16,11.61 45.16,17.58 v44.52,18.21
VIN  (via drill 0.6, 1)
  Top 1.27: v68.02,71.81 68.15,71.68 R14.2 R15.2 v68.15,61.9 | v22.3,19.74 v27.38,19.74
  Bottom 1.27: v68.02,71.81 J2.1 | 36.14,35.99 53.41,35.99 56.97,39.55 56.97,46.54 60.27,49.84 64.34,49.84 68.15,53.65 v68.15,61.9 | U$3.8 36.27,36.12 36.14,35.99 | S6.1 S6.4 21.03,22.28 22.3,21.01 v22.3,19.74 U$22.1 | v27.38,19.74 32.46,19.74 J4.1 30.3,26.98 | 36.14,35.99 29.66,35.99 28.65,34.98 28.65,28.63 30.3,26.98 | U$13.1 31.06,27.74 30.3,26.98
(copper drawn outside any net)
  shapes: Bottom circle x1, Top circle x1

### Text on the board
tPlace: US2 | LF | RST | D12 | LINE FOLLOWER | - | front | GND | 5V | sd | sc | 5V | GND | VIN | D13 | + | D11 | P2 | lcd | PRAK. KENDALI / CERDAS | top | Mot L | ESP01 | US3 | BUZZ | US1 | DRIVER | IMU | Mot R | TH. 2019 | POWER ON | P1 | A71 | A61 | A31 | A21 | A11 | A01 | bimekasolution@gmail.com | LAB / ROBOTIC VEHICLE | - | + | JP | O/F | COM SW | WALL FOLLOWER | D13 | WF | RST | D11 | D12